# EAGLE design Central_Unit_V2 (EAGLE 9.6.2)
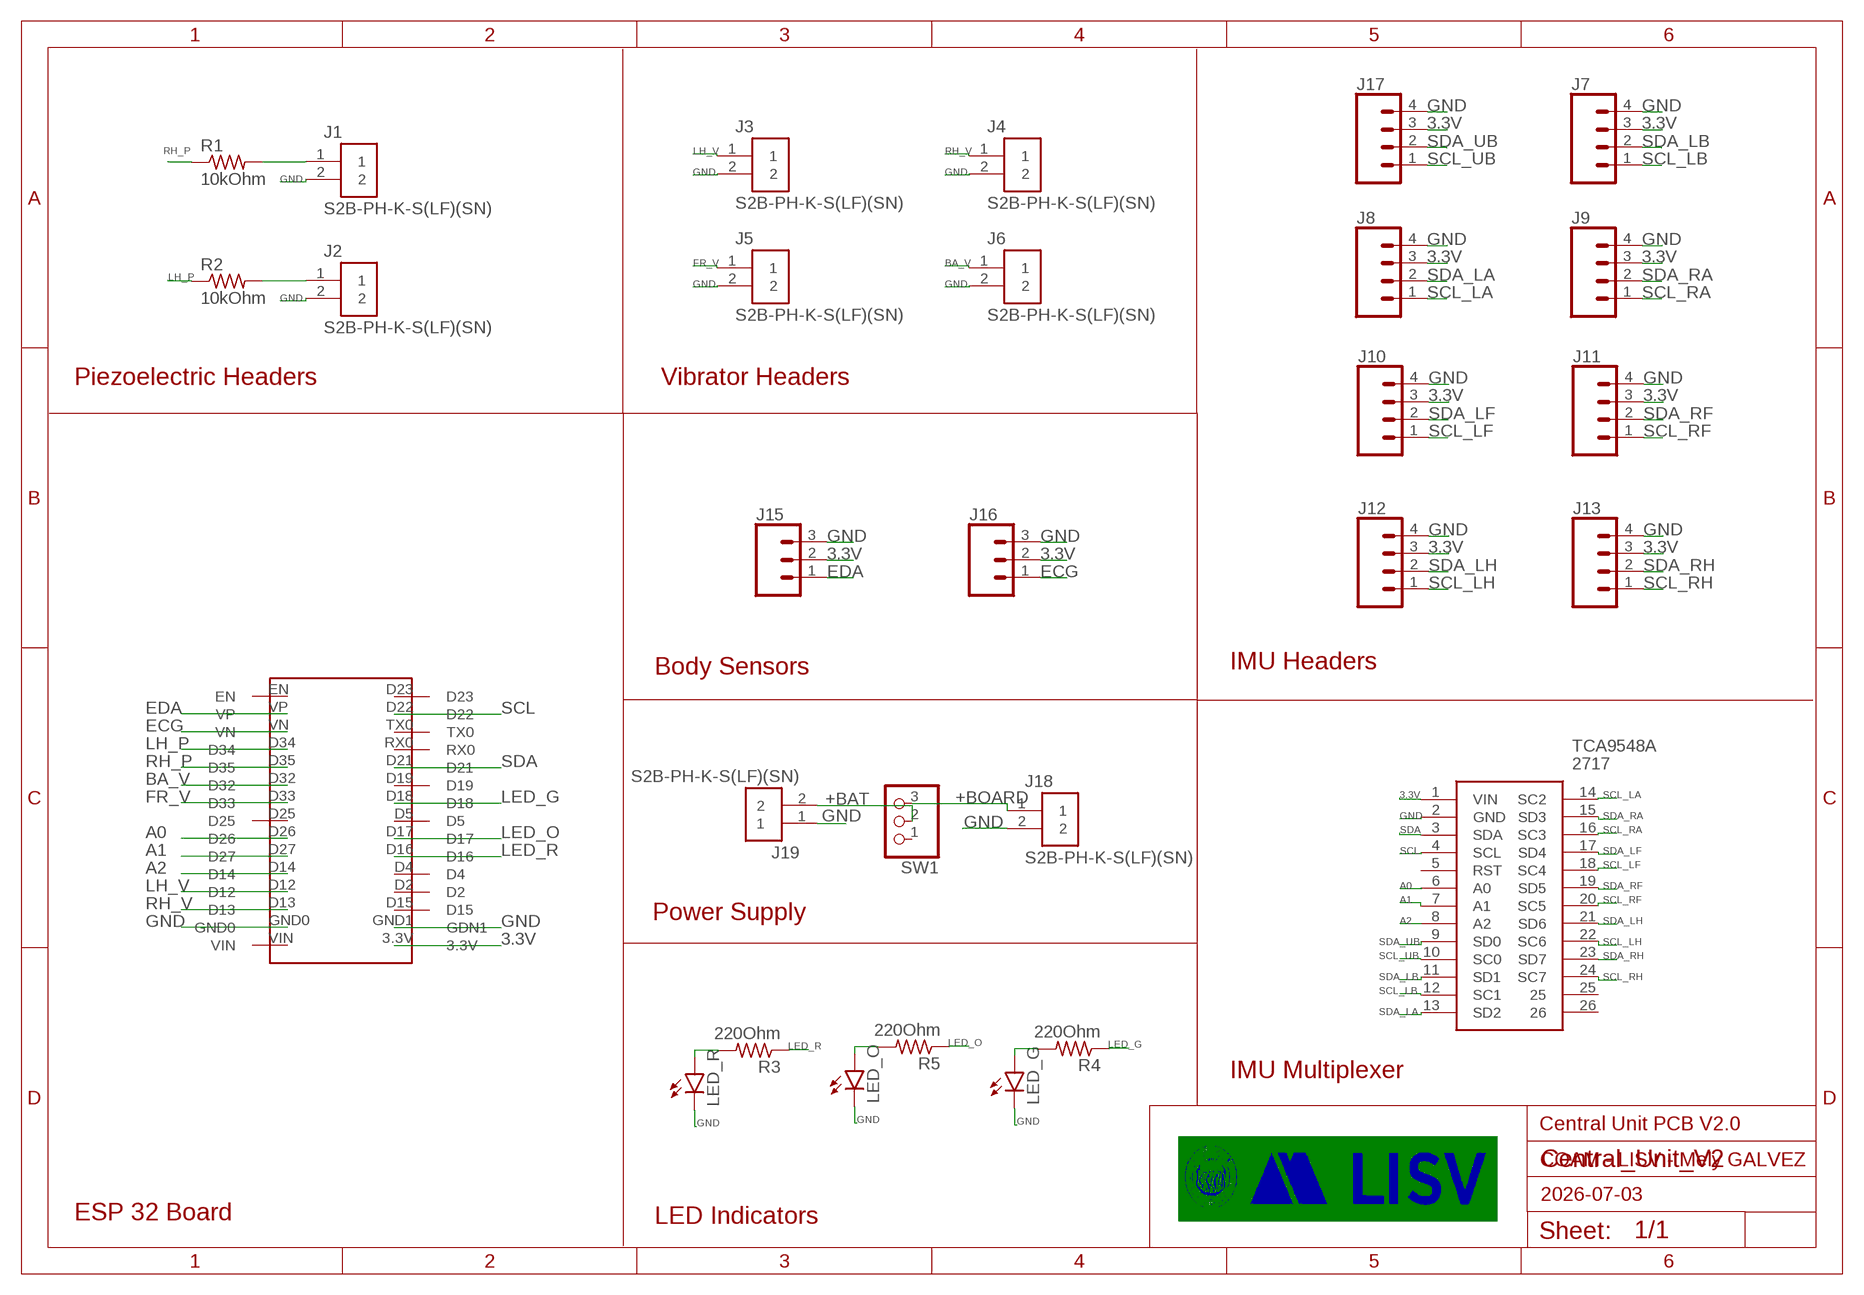
[diagram p0: schematic, sheet 1]

## Parts
J1  S2B-PH-K-S(LF)(SN)  [S2B-PH-K-S(LF)(SN)]
J2  S2B-PH-K-S(LF)(SN)  [S2B-PH-K-S(LF)(SN)]
J3  S2B-PH-K-S(LF)(SN)  [S2B-PH-K-S(LF)(SN)]
J4  S2B-PH-K-S(LF)(SN)  [S2B-PH-K-S(LF)(SN)]
J5  S2B-PH-K-S(LF)(SN)  [S2B-PH-K-S(LF)(SN)]
J6  S2B-PH-K-S(LF)(SN)  [S2B-PH-K-S(LF)(SN)]
J7  CONN_04JST-PTH  [JST-4-PTH]
J8  CONN_04JST-PTH  [JST-4-PTH]
J9  CONN_04JST-PTH  [JST-4-PTH]
J10  CONN_04JST-PTH  [JST-4-PTH]
J11  CONN_04JST-PTH  [JST-4-PTH]
J12  CONN_04JST-PTH  [JST-4-PTH]
J13  CONN_04JST-PTH  [JST-4-PTH]
J15  CONN_03JST-PTH  [JST-3-PTH]
J16  CONN_03JST-PTH  [JST-3-PTH]
J17  CONN_04JST-PTH  [JST-4-PTH]
J18  S2B-PH-K-S(LF)(SN)  [S2B-PH-K-S(LF)(SN)]
J19  S2B-PH-K-S(LF)(SN)  [S2B-PH-K-S(LF)(SN)]
LED_G  LED3MM  [LED3MM]
LED_O  LED3MM  [LED3MM]
LED_R  LED3MM  [LED3MM]
R1  10kOhm  R-US_0207/10  [0207/10]
R2  10kOhm  R-US_0207/10  [0207/10]
R3  220Ohm  R-US_0207/10  [0207/10]
R4  220Ohm  R-US_0207/10  [0207/10]
R5  220Ohm  R-US_0207/10  [0207/10]
SW1  PINHD-1X3  [1X03]
TCA9548A  2717  [2717]
U$1  ESP32_WROUM32  [ESP32_WROUM32]

## Nets
3.3V: J7.3 J8.3 J9.3 J10.3 J11.3 J12.3 J13.3 J15.2 J16.2 J17.3 TCA9548A.1(VIN) U$1.3.3V
+BAT: J19.2 SW1.2
+BOARD: J18.1 SW1.3
A0: TCA9548A.6(A0) U$1.D26
A1: TCA9548A.7(A1) U$1.D27
A2: TCA9548A.8(A2) U$1.D14
BA_V: J6.1 U$1.D32
ECG: J16.1 U$1.VN
EDA: J15.1 U$1.VP
FR_V: J5.1 U$1.D33
GND: J1.2 J2.2 J3.2 J4.2 J5.2 J6.2 J7.4 J8.4 J9.4 J10.4 J11.4 J12.4 J13.4 J15.3 J16.3 J17.4 J18.2 J19.1 LED_G.K(C) LED_O.K(C) LED_R.K(C) TCA9548A.2(GND) U$1.GND0 U$1.GND1(GDN1)
LED_G: R4.1 U$1.D18
LED_O: R5.1 U$1.D17
LED_R: R3.1 U$1.D16
LH_P: R2.1 U$1.D34
LH_V: J3.1 U$1.D12
N$1: J1.1 R1.2
N$2: J2.1 R2.2
N$3: LED_R.A R3.2
N$4: LED_G.A R4.2
N$5: LED_O.A R5.2
RH_P: R1.1 U$1.D35
RH_V: J4.1 U$1.D13
SCL: TCA9548A.4(SCL) U$1.D22
SCL_LA: J8.1 TCA9548A.14(SC2)
SCL_LB: J7.1 TCA9548A.12(SC1)
SCL_LF: J10.1 TCA9548A.18(SC4)
SCL_LH: J12.1 TCA9548A.22(SC6)
SCL_RA: J9.1 TCA9548A.16(SC3)
SCL_RF: J11.1 TCA9548A.20(SC5)
SCL_RH: J13.1 TCA9548A.24(SC7)
SCL_UB: J17.1 TCA9548A.10(SC0)
SDA: TCA9548A.3(SDA) U$1.D21
SDA_LA: J8.2 TCA9548A.13(SD2)
SDA_LB: J7.2 TCA9548A.11(SD1)
SDA_LF: J10.2 TCA9548A.17(SD4)
SDA_LH: J12.2 TCA9548A.21(SD6)
SDA_RA: J9.2 TCA9548A.15(SD3)
SDA_RF: J11.2 TCA9548A.19(SD5)
SDA_RH: J13.2 TCA9548A.23(SD7)
SDA_UB: J17.2 TCA9548A.9(SD0)
Unconnected: SW1.1 TCA9548A.5(RST) TCA9548A.25 TCA9548A.26 U$1.D2 U$1.D4 U$1.D5 U$1.D15 U$1.D19 U$1.D23 U$1.D25 U$1.EN U$1.RX0 U$1.TX0 U$1.VIN

## Notes on the sheet
- Piezoelectric Headers | Vibrator Headers
- Body Sensors | IMU Headers
- Power Supply
- IMU Multiplexer
- Central Unit PCB V2.0
- COAM - LISV - Mely GALVEZ
- 2026-07-03
- ESP 32 Board | LED Indicators

## Library data of the parts
J1-J6 J18 J19 = Connectors:S2B-PH-K-S(LF)(SN): CONN HEADER R/A 2POS 2MM Manufacturer's datasheet <http://www.jst-mfg.com/product/pdf/eng/ePH.pdf>; CREATED_BY: PCBLayout.com; DIGI_KEY_PART_NUMBER: 455-1719-ND; MANUFACTURER: JST Sales America Inc.; MPN: S2B-PH-K-S(LF)(SN)
J7-J13 J17 = SparkFun-Connectors:CONN_04: Multi connection point. Often used as Generic Header-pin footprint for 0.1 inch spaced/style header connections On any of the 0.1 inch spaced packages, you can populate with these: Break Away Headers - Straight <https://www.sparkfun.com/products/116> (PRT-00116) Break Away Male Headers - Right Angle <https://www.sparkfun.com/products/553> (PRT-00553) Female Headers <https://www.sparkfun.com/products/115> (PRT-00115) Break Away Headers - Machine Pin <https://www.sparkfun.com/products/117> (PRT-00117) Break Away Female Headers - Swiss Machine Pin <https://www.sparkfun.com/products/743> (PRT-00743) For SCREWTERMINALS and SPRING TERMINALS visit here: Screw Terimnals on SparkFun.com <https://www.sparkfun.com/search/results?term=Screw+Terminals> (5mm/3.5mm/2.54mm spacing) This device is also useful as a general connection point to wire up your design to another part of your project. Our various solder wires solder well into these plated through hole pads. Hook-Up Wire - Assortment (Stranded, 22 AWG) <https://www.sparkfun.com/products/11375> (PRT-11375) Hook-Up Wire - Assortment (Solid Core, 22 AWG) <https://www.sparkfun.com/products/11367> (PRT-11367) View the entire wire category on our website here <https://www.sparkfun.com/categories/141> Special notes: Molex polarized connector foot print use with SKU : PRT-08231 with associated crimp pins and housings. 1MM SMD Version SKU: PRT-10208; PROD_ID: WIRE-13531; SF_ID: PRT-09916
J15 J16 = SparkFun-Connectors:CONN_03: Multi connection point. Often used as Generic Header-pin footprint for 0.1 inch spaced/style header connections On any of the 0.1 inch spaced packages, you can populate with these: Break Away Headers - Straight <https://www.sparkfun.com/products/116> (PRT-00116) Break Away Male Headers - Right Angle <https://www.sparkfun.com/products/553> (PRT-00553) Female Headers <https://www.sparkfun.com/products/115> (PRT-00115) Break Away Headers - Machine Pin <https://www.sparkfun.com/products/117> (PRT-00117) Break Away Female Headers - Swiss Machine Pin <https://www.sparkfun.com/products/743> (PRT-00743) Stackable Header - 3 Pin (Female, 0.1") <https://www.sparkfun.com/products/13875> (PRT-13875) For SCREWTERMINALS and SPRING TERMINALS visit here: Screw Terimnals on SparkFun.com <https://www.sparkfun.com/search/results?term=Screw+Terminals> (5mm/3.5mm/2.54mm spacing) This device is also useful as a general connection point to wire up your design to another part of your project. Our various solder wires solder well into these plated through hole pads. Hook-Up Wire - Assortment (Stranded, 22 AWG) <https://www.sparkfun.com/products/11375> (PRT-11375) Hook-Up Wire - Assortment (Solid Core, 22 AWG) <https://www.sparkfun.com/products/11367> (PRT-11367) View the entire wire category on our website here <https://www.sparkfun.com/categories/141> Special notes: Molex polarized connector foot print use with SKU : PRT-08232 with associated crimp pins and housings.; PROD_ID: WIRE-10037; SF_ID: PRT-09915
LED_G LED_O LED_R = led:LED: LED OSRAM: - CHIPLED LG R971, LG N971, LY N971, LG Q971, LY Q971, LO R971, LY R971 LH N974, LH R974 LS Q976, LO Q976, LY Q976 LO Q996 - Hyper CHIPLED LW Q18S LB Q993, LB Q99A, LB R99A - SideLED LS A670, LO A670, LY A670, LG A670, LP A670 LB A673, LV A673, LT A673, LW A673 LH A674 LY A675 LS A676, LA A676, LO A676, LY A676, LW A676 LS A679, LY A679, LG A679 - Hyper Micro SIDELED® LS Y876, LA Y876, LO Y876, LY Y876 LT Y87S - SmartLED LW L88C, LW L88S LB L89C, LB L89S, LG L890 LS L89K, LO L89K, LY L89K LS L896, LA L896, LO L896, LY L896 - TOPLED LS T670, LO T670, LY T670, LG T670, LP T670 LSG T670, LSP T670, LSY T670, LOP T670, LYG T670 LG T671, LOG T671, LSG T671 LB T673, LV T673, LT T673, LW T673 LH T674 LS T676, LA T676, LO T676, LY T676, LB T676, LH T676, LSB T676, LW T676 LB T67C, LV T67C, LT T67C, LS T67K, LO T67K, LY T67K, LW E67C LS E67B, LA E67B, LO E67B, LY E67B, LB E67C, LV E67C, LT E67C LW T67C LS T679, LY T679, LG T679 LS T770, LO T770, LY T770, LG T770, LP T770 LB T773, LV T773, LT T773, LW T773 LH T774 LS E675, LA E675, LY E675, LS T675 LS T776, LA T776, LO T776, LY T776, LB T776 LHGB T686 LT T68C, LB T68C - Hyper Mini TOPLED® LB M676 - Mini TOPLED Santana® LG M470 LS M47K, LO M47K, LY M47K Source: http://www.osram.convergy.de LUXEON: - LUMILED® LXK2-PW12-R00, LXK2-PW12-S00, LXK2-PW14-U00, LXK2-PW14-V00 LXK2-PM12-R00, LXK2-PM12-S00, LXK2-PM14-U00 LXK2-PE12-Q00, LXK2-PE12-R00, LXK2-PE12-S00, LXK2-PE14-T00, LXK2-PE14-U00 LXK2-PB12-K00, LXK2-PB12-L00, LXK2-PB12-M00, LXK2-PB14-N00, LXK2-PB14-P00, LXK2-PB14-Q00 LXK2-PR12-L00, LXK2-PR12-M00, LXK2-PR14-Q00, LXK2-PR14-R00 LXK2-PD12-Q00, LXK2-PD12-R00, LXK2-PD12-S00 LXK2-PH12-R00, LXK2-PH12-S00 LXK2-PL12-P00, LXK2-PL12-Q00, LXK2-PL12-R00 Source: www.luxeon.com KINGBRIGHT: KA-3528ASYC Source: www.kingbright.com
R1-R5 = adafruit:R-US_: RESISTOR, American symbol
SW1 = pinhead:PINHD-1X3: PIN HEADER
TCA9548A = TCA9548A_m:2717: Switch IC Development Tools TCA9548A I2C Multiplexer Source: Datasheet <https://learn.adafruit.com/downloads/pdf/adafruit-tca9548a-1-to-8-i2c-multiplexer-breakout.pdf>; DESCRIPTION: Switch IC Development Tools TCA9548A I2C Multiplexer; HEIGHT: 1mm; MANUFACTURER_NAME: Adafruit; MANUFACTURER_PART_NUMBER: 2717; MOUSER_PART_NUMBER: 485-2717; MOUSER_PRICE-STOCK: https://www.mouser.com/Search/Refine.aspx?Keyword=485-2717
U$1 = ESP32_WROUM32:ESP32_WROUM32

## Board
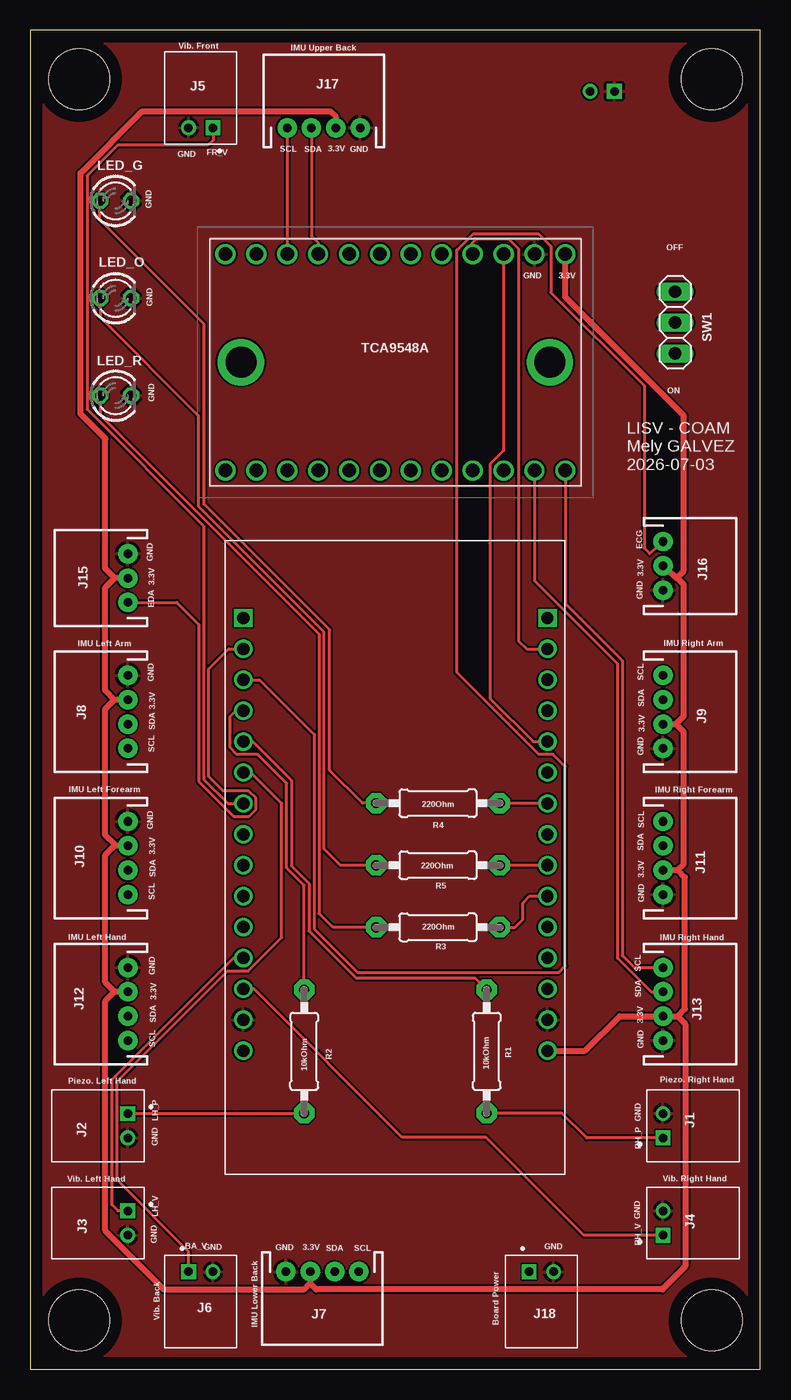
[diagram p1: board, top side]
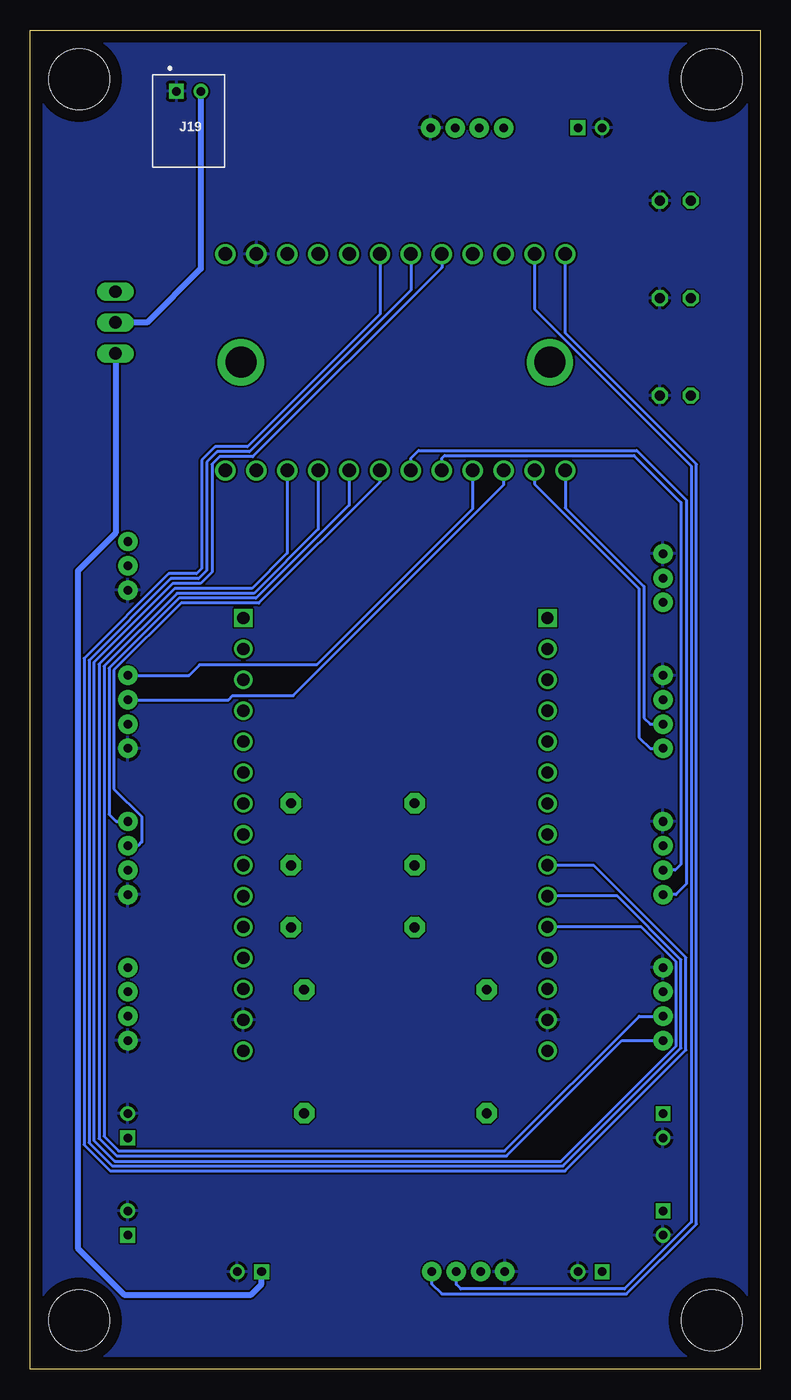
[diagram p2: board, bottom side, seen from below]

Size 60 x 110 mm. Coordinates in mm from the lower left corner, seen from the top.
Outline: 0,0 60,0 60,110 0,110 0,0
Copper layers (1*16): Top 0.035mm / dielectric 1.5mm / Bottom 0.035mm
Design rules "default": minimum track width 6mil, minimum drill 0.35mm, track to track 6mil, track to pad 6mil, pad to pad 6mil, via to via 6mil, smd to smd 6mil, copper to edge 40mil, drill to drill 6mil, minimum pad ring 10mil, minimum via ring 8mil, stop-mask expansion 4mil, vias tented up to drill 0mil, thermal gap 10mil
Holes 5 mm at 4,4 56,4 56,106 4,106

### Footprints (pad centres in the part's own frame; a part is rotated, then mirrored left to right if it is on the bottom)
S2B-PH-K-S(LF)(SN) = drill 0.7 square: 1 -1,0 | drill 0.7: 2 1,0
JST-4-PTH = drill 0.7 pad 1.6: 1 -3,0; 2 -1,0; 3 1,0; 4 3,0
JST-3-PTH = drill 0.7 pad 1.6: 1 -2,0; 2 0,0; 3 2,0
LED3MM = drill 0.813 octagon: A -1.27,0; K 1.27,0
0207/10 = drill 0.813 pad 1.676 octagon: 1 -5.08,0; 2 5.08,0
1X03 = drill 1.016 long: 1 -2.54,0; 2 0,0; 3 2.54,0
2717 = drill 1.11 pad 1.665: 1 -7.62,13.97; 2 -7.62,11.43; 3 -7.62,8.89; 4 -7.62,6.35; 5 -7.62,3.81; 6 -7.62,1.27; 7 -7.62,-1.27; 8 -7.62,-3.81; 9 -7.62,-6.35; 10 -7.62,-8.89; 11 -7.62,-11.43; 12 -7.62,-13.97; 13 10.16,-13.97; 14 10.16,-11.43; 15 10.16,-8.89; 16 10.16,-6.35; 17 10.16,-3.81; 18 10.16,-1.27; 19 10.16,1.27; 20 10.16,3.81; 21 10.16,6.35; 22 10.16,8.89; 23 10.16,11.43; 24 10.16,13.97 | drill 2.54 pad 3.81: 25 1.27,12.7; 26 1.27,-12.7
ESP32_WROUM32 = drill 1: 3.3V 26.5,10.16; D2 26.5,17.78; D4 26.5,20.32; D5 26.5,27.94; D12 1.5,17.78; D13 1.5,15.24; D14 1.5,20.32; D15 26.5,15.24; D16 26.5,22.86; D17 26.5,25.4; D18 26.5,30.48; D19 26.5,33.02; D21 26.5,35.56; D22 26.5,43.18; D25 1.5,27.94; D26 1.5,25.4; D27 1.5,22.86; D32 1.5,33.02; D33 1.5,30.48; D34 1.5,38.1; D35 1.5,35.56; GND0 1.5,12.7; GND1 26.5,12.7; RX0 26.5,38.1; TX0 26.5,40.64; VIN 1.5,10.16; VN 1.5,40.64; VP 1.5,43.18 | drill 1 square: D23 26.5,45.72; EN 1.5,45.72

### Placement (x,y rotation side)
J1  52,20 90 top
J2  8,20 270 top
J3  8,12 270 top
J4  52,12 90 top
J5  14,102 180 top
J6  14,8 0 top
J7  24,8 180 top
J8  8,54 90 top
J9  52,54 270 top
J10  8,42 90 top
J11  52,42 270 top
J12  8,30 90 top
J13  52,30 270 top
J15  8,65 90 top
J16  52,66 270 top
J17  24.1,102 0 top
J18  42,8 0 top
J19  47,105 0 bottom
LED_G  7,96 0 top
LED_O  7,88 0 top
LED_R  7,80 0 top
R1  37.5,26.1 270 top
R2  22.5,26.1 270 top
R3  33.5,36.3 180 top
R4  33.5,46.5 180 top
R5  33.5,41.4 180 top
SW1  53,86 270 top
TCA9548A  30,84 270 top
U$1  16,16 0 top

### Tracks (layer width: path | path; a pad name or v marks a point on that pad's centre or on a via)
3.3V
  Top 0.5: U$1.3.3V 45.59,26.16 48.43,29 J13.3 53.21,29 | 53.21,29 53.8,29.59 53.8,40.41 53.21,41 J11.3 53.22,41 53.7,41.48 53.7,52.35 53.05,53 | TCA9548A.1 43.97,88.08 53.7,78.36 53.7,65.58 53.11,65 | J16.2 53.11,65 | 53.11,65 53.16,65 53.7,64.47 53.7,53.65 53.05,53 | J9.3 53.05,53 | 53.21,29 53.21,28.96 53.82,28.35 53.82,8.43 51.94,6.55 23.5,6.55 23,7.05 J7.3 23,7.05 22.48,6.53 11,6.53 6.15,11.38 6.15,30.25 6.89,31 6.92,31 | J12.3 6.92,31 | 6.92,31 6.15,31.77 6.15,42.27 6.88,43 | J10.3 6.88,43 | 6.88,43 6.88,43.13 6.15,43.87 6.15,54.25 6.9,55 | J8.3 6.9,55 | 6.9,55 6.15,55.75 6.15,64.24 6.91,65 | J15.2 6.91,65 | 6.91,65 6.15,65.76 6.15,76.45 4.12,78.49 4.12,98.27 9.2,103.35 24.64,103.35 25.1,102.89 J17.3
+BAT
  Bottom 0.5: J19.2 46,90.42 50.42,86 SW1.2
+BOARD
  Bottom 0.5: SW1.3 53,68.7 56.11,65.59 56.11,9.94 52.3,6.12 41.86,6.12 41,6.98 J18.1
A0
  Bottom 0.25: TCA9548A.6 31.27,86.68 42.16,75.79 44.81,75.79 45.91,74.68 45.91,65.79 46.35,65.36 48.62,65.36 55.59,58.4 55.59,18.43 53.43,16.28 16.06,16.28 6.12,26.22 6.12,33.82 13.7,41.4 U$1.D26
A1
  Bottom 0.25: TCA9548A.7 28.73,88.65 41.99,75.38 44.64,75.38 45.51,74.51 45.51,65.62 46.18,64.95 48.46,64.95 55.18,58.23 55.18,18.6 53.26,16.68 16.23,16.68 6.52,26.39 6.52,33.63 11.75,38.86 U$1.D27
A2
  Bottom 0.25: TCA9548A.8 26.19,90.52 41.73,74.98 44.45,74.98 45.09,74.35 45.09,65.48 46.02,64.55 48.29,64.55 54.78,58.06 54.78,18.79 53.07,17.08 16.39,17.08 6.92,26.55 6.92,33.46 9.78,36.32 U$1.D14
BA_V
  Top 0.25: J6.1 13,9.66 7.11,15.54 7.11,23.62 16.2,32.72 17.91,32.72 20.65,35.46 20.65,46.48 18.11,49.02 U$1.D32
ECG
  Top 0.25: U$1.VN 18.82,56.64 23.32,52.15 23.32,36.17 26.87,32.61 43.43,32.61 43.94,33.12 43.94,49.53 42.95,50.52 41.78,50.52 35.05,57.25 35.05,91.95 36.4,93.29 41.76,93.29 42.77,92.28 42.77,88.47 50.44,80.8 50.44,67.46 50.91,67 J16.1
EDA
  Top 0.25: J15.1 12.03,63 13.84,61.19 13.84,48.28 16.71,45.41 17.96,45.41 18.54,46 18.54,46.91 17.93,47.52 15.82,47.52 14.66,48.69 14.66,57.53 16.3,59.18 U$1.VP
FR_V
  Top 0.25: J5.1 15,100.98 14.61,100.58 7.19,100.58 4.65,98.04 4.65,78.87 14.25,69.27 14.25,48.46 16.23,46.48 U$1.D33
GND
  pour Top: 0,0 0,110 60,110 60,0
  pour Bottom: 0,0 0,110 60,110 60,0
LED_G
  Top 0.25: U$1.D18 38.6,46.48 R4.1
LED_O
  Top 0.25: U$1.D17 R5.1
LED_R
  Top 0.25: R3.1 39.83,36.3 40.46,36.93 40.46,38.3 41.02,38.86 U$1.D16
LH_P
  Top 0.25: R2.1 22.5,39.76 21.06,41.2 21.06,48.13 18.67,50.52 16.97,50.52 16.41,51.08 16.41,53.62 16.89,54.1 U$1.D34
LH_V
  Top 0.25: J3.1 7.19,13 6.71,13.49 6.71,23.8 16.69,33.78 U$1.D12
N$1
  Top 0.25: J1.1 45.72,19 43.7,21.02 R1.2
N$2
  Top 0.25: J2.1 22.48,21 R2.2
N$3
  Top 0.25: R3.2 24.86,36.3 23.72,37.44 23.72,60.4 5.73,78.39 LED_R.A
N$4
  Top 0.25: R4.2 27.29,46.5 24.59,49.2 24.59,60.76 14.28,71.07 14.28,85.88 5.71,94.45 5.71,95.97 LED_G.A
N$5
  Top 0.25: R5.2 25.48,41.4 24.13,42.75 24.13,60.58 13.79,70.92 13.79,78.36 5.73,86.42 LED_O.A
RH_P
  Top 0.25: R1.1 36.55,32.13 26.77,32.13 22.9,36 22.9,39.92 21.46,41.36 21.46,48.36 18.27,51.56 U$1.D35
RH_V
  Top 0.25: J4.1 45.49,11 37.44,19.05 30.56,19.05 18.37,31.24 U$1.D13
SCL
  Top 0.25: TCA9548A.4 36.35,92.56 36.68,92.89 39.29,92.89 40.13,92.05 40.13,59.84 40.79,59.18 U$1.D22
SCL_LA
  Bottom 0.25: TCA9548A.14 18.57,72.72 9.98,64.14 9.98,51.92 9.06,51 J8.1
SCL_LB
  Bottom 0.25: J7.1 27,6.99 26.19,6.17 11,6.17 5.26,11.91 5.26,74.36 16.03,85.13 TCA9548A.12
SCL_LF
  Bottom 0.25: TCA9548A.18 28.73,74.85 28.09,75.49 10.16,75.49 6.07,71.4 6.07,39.88 6.95,39 J10.1
SCL_LH
  Bottom 0.25: TCA9548A.22 38.89,67.05 41.79,64.15 48.12,64.15 54.35,57.92 54.35,18.96 52.9,17.51 20.87,17.51 11.38,27 J12.1
SCL_RA
  Bottom 0.25: TCA9548A.16 23.65,70.69 36.47,57.86 46.1,57.86 46.96,57 J9.1
SCL_RF
  Bottom 0.25: TCA9548A.20 33.81,70.99 41.46,63.34 47.79,63.34 53.54,57.6 53.54,45.59 52.95,45 J11.1
SCL_RH
  Top 0.25: TCA9548A.24 43.97,62.89 48.64,58.22 48.64,33.98 49.63,33 J13.1
SCL_UB
  Top 0.25: J17.1 TCA9548A.10
SDA
  Top 0.25: TCA9548A.3 38.89,75.47 37.78,74.36 37.78,55.11 41.33,51.56 U$1.D21
SDA_LA
  Bottom 0.25: TCA9548A.13 16.03,70.77 9.58,64.31 9.58,53.52 9.06,53 J8.2
SDA_LB
  Bottom 0.25: TCA9548A.11 18.57,87.1 5.67,74.2 5.67,12.09 11.18,6.58 24.61,6.58 25,6.97 J7.2
SDA_LF
  Bottom 0.25: TCA9548A.17 26.19,74.85 25.96,75.08 10.39,75.08 6.53,71.22 6.53,41.48 7.01,41 J10.2
SDA_LH
  Bottom 0.25: TCA9548A.21 36.35,69.02 41.62,63.75 47.96,63.75 53.95,57.76 53.95,19.13 52.76,17.93 21.03,17.93 9.96,29 J12.2
SDA_RA
  Bottom 0.25: TCA9548A.15 21.11,72.64 38.41,55.35 43.38,55.35 43.73,55 J9.2
SDA_RF
  Bottom 0.25: TCA9548A.19 31.27,72.9 41.23,62.94 47.62,62.94 53.14,57.43 53.14,47.68 50.85,45.39 50.85,43.31 51.16,43 J11.2
SDA_RH
  Top 0.25: TCA9548A.23 41.43,64.79 48.23,57.99 48.23,33.78 51.02,31 J13.2
SDA_UB
  Top 0.25: J17.2 23.1,93.11 23.65,92.56 TCA9548A.9

### Text on the board
tNames: Vib. Front | IMU Upper Back | GND | GND | FR_V | SCL | SDA | 3.3V | GND | OFF | GND | 3.3V | GND | ON | GND | LISV - COAM / Mely GALVEZ / 2026-07-03 | 3.3V | ECG | 3.3V | GND | EDA | GND | IMU Left Arm | IMU Right Arm | SCL | 3.3V | GND | 3.3V | SDA | SDA | SCL | GND | IMU Left Forearm | IMU Right Forearm | 3.3V | GND | SCL | SDA | 3.3V | SDA | SCL | GND | IMU Left Hand | IMU Right Hand | SCL | 3.3V | GND | SDA | 3.3V | SDA | SCL | GND | Piezo. Right Hand | Piezo. Left Hand | LH_P | GND | GND | RH_P | Vib. Left Hand | Vib. Right Hand | LH_V | GND | GND | BA_V | GND | GND | 3.3V | SDA | SCL | GND | RH_V | Vib. Back | Board Power | IMU Lower Back